# EAGLE schematic CANSAT (EAGLE 9.5.1)
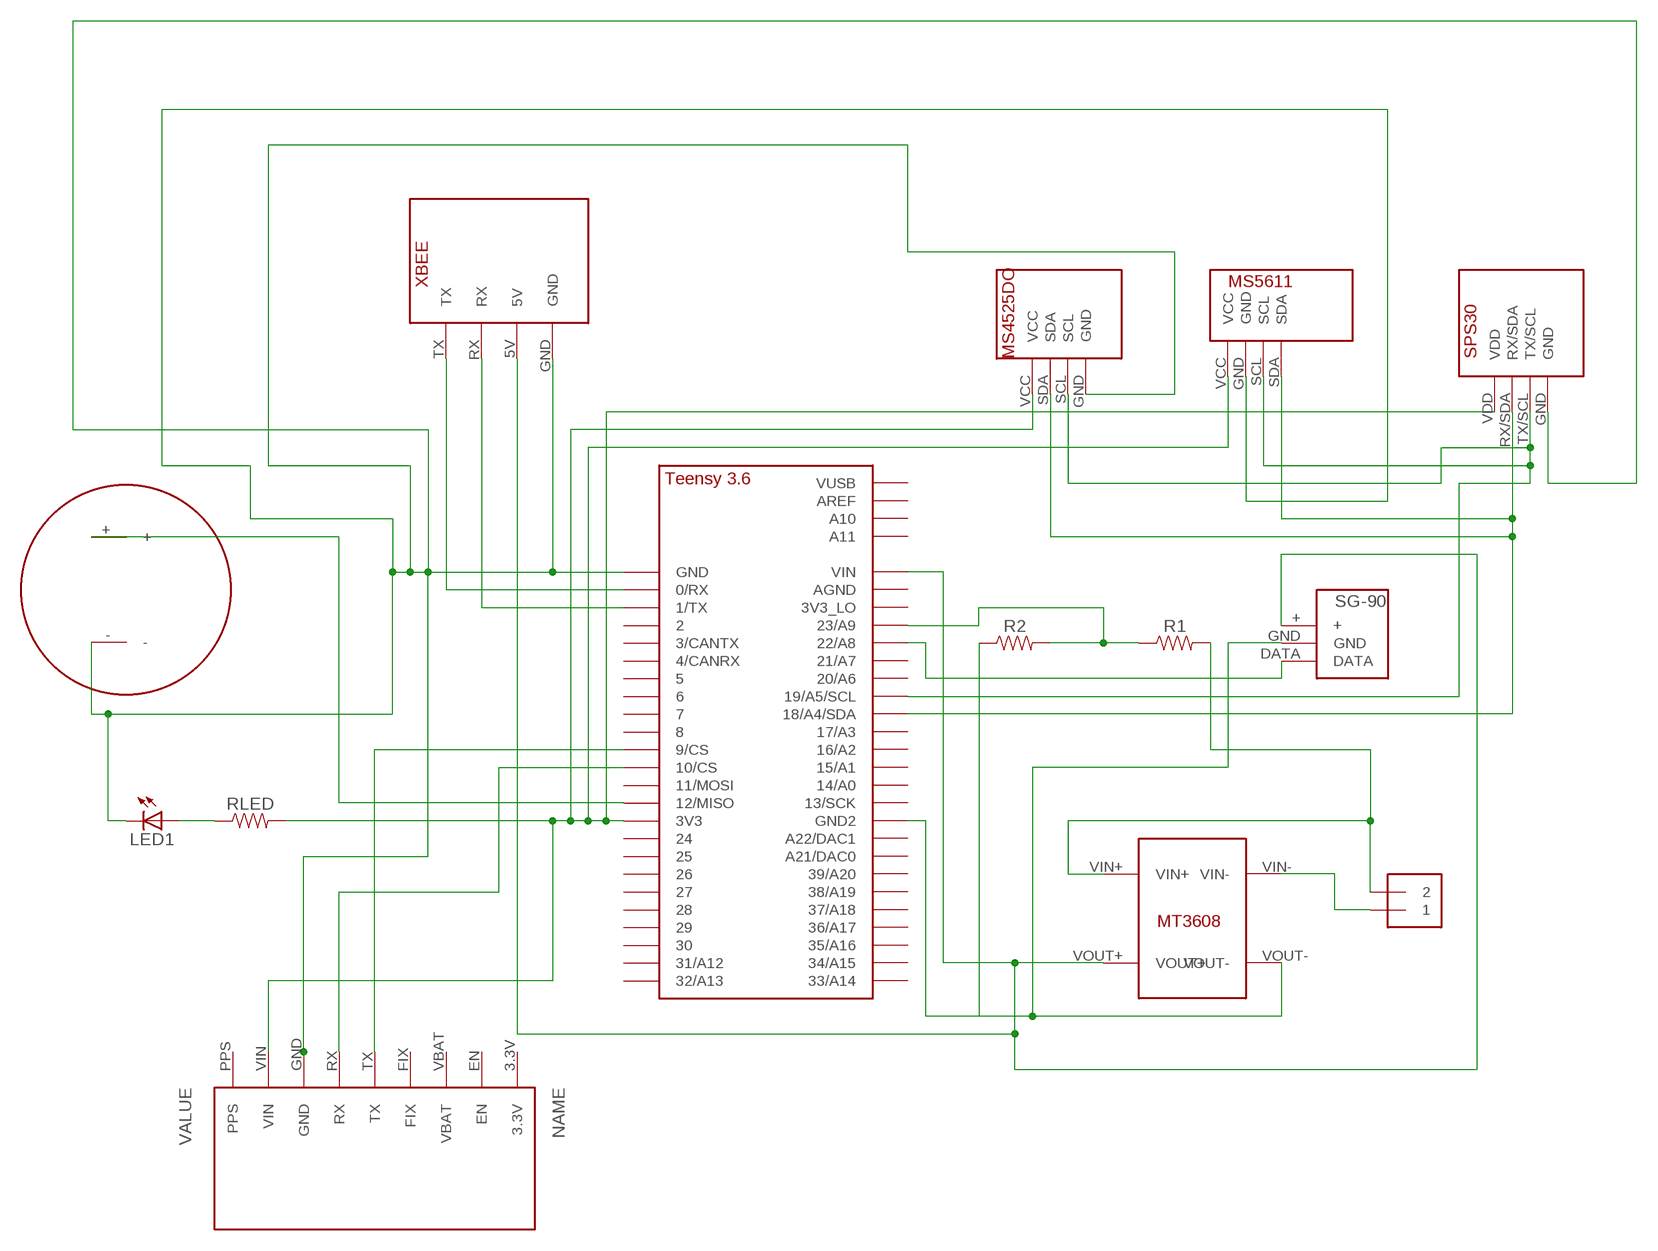
[diagram p0: schematic, sheet 1]

## Parts
GPS1  ADAFRUITGPSBREAKOUT  [ADAFRUITGPS]
J1  1X2-3.5MM  [1X2-3.5MM]
LED1  LED5MM  [LED5MM]
R1  1.2K  RESISTORAXIAL-0.3  [AXIAL-0.3]
R2  2.5K  RESISTORAXIAL-0.3  [AXIAL-0.3]
RLED  220  RESISTORAXIAL-0.3  [AXIAL-0.3]
U$1  MT3608  [MT3608]
U$2  TEENSY_3.5/3.6_BASIC  [TEENSY_3.5/3.6_BASIC]
U$3  XBEE-S2CPRO  [XBEE-S2CPRO]
U$4  MS4525DO  [MS4525DO]
U$5  MS5611  [MS5611]
U$6  SPS30  [SPS30]
U$7  AL-3035  [BUZZER]
U$8  SG-90  [SG-90]

## Nets
3V3: GPS1.VIN RLED.P$2 U$2.3V3 U$4.VCC U$5.VCC U$6.VDD
5V: U$1.VOUT+ U$2.VIN U$3.5V U$8.+
GND: GPS1.GND LED1.K(C) U$2.GND U$3.GND U$4.GND U$5.GND U$6.GND U$7.-
GND2: R2.P$1 U$1.VOUT- U$2.GND2 U$8.GND
N$1: U$2.0/RX U$3.TX
N$2: LED1.A RLED.P$1
N$3: U$2.1/TX U$3.RX
N$4: J1.2 R1.P$2 U$1.VIN+
N$5: J1.1 U$1.VIN-
N$6: U$2.22/A8 U$8.DATA
N$7: U$2.12/MISO U$7.+
N$8: GPS1.TX U$2.9/CS
N$9: R1.P$1 R2.P$2 U$2.23/A9
N$10: GPS1.RX U$2.10/CS
SCL: U$2.19/A5/SCL U$4.SCL U$5.SCL U$6.TX/SCL
SDA: U$2.18/A4/SDA U$4.SDA U$5.SDA U$6.RX/SDA
Unconnected: GPS1.3.3V GPS1.EN GPS1.FIX GPS1.PPS GPS1.VBAT U$2.2 U$2.3/CANTX U$2.3V3_LO U$2.4/CANRX U$2.5 U$2.6 U$2.7 U$2.8 U$2.11/MOSI U$2.13/SCK U$2.14/A0 U$2.15/A1 U$2.16/A2 U$2.17/A3 U$2.20/A6 U$2.21/A7 U$2.21/DAC0(A21/DAC0) U$2.24 U$2.25 U$2.26 U$2.27 U$2.28 U$2.29 U$2.30 U$2.31/A12 U$2.32/A13 U$2.33/A14 U$2.34/A15 U$2.35/A16 U$2.36/A17 U$2.37/A18 U$2.38/A19 U$2.39/A20 U$2.A10 U$2.A11 U$2.A22/DAC1 U$2.AGND U$2.AREF U$2.VUSB

## Library data of the parts
GPS1 = AdafruitGPSbreakout:ADAFRUITGPSBREAKOUT
J1 = adafruit:1X2: 3.5mm Terminal block http://www.ladyada.net/library/pcb/eaglelibrary.html
LED1 = adafruit:LED: LED OSRAM: - CHIPLED LG R971, LG N971, LY N971, LG Q971, LY Q971, LO R971, LY R971 LH N974, LH R974 LS Q976, LO Q976, LY Q976 LO Q996 - Hyper CHIPLED LW Q18S LB Q993, LB Q99A, LB R99A - SideLED LS A670, LO A670, LY A670, LG A670, LP A670 LB A673, LV A673, LT A673, LW A673 LH A674 LY A675 LS A676, LA A676, LO A676, LY A676, LW A676 LS A679, LY A679, LG A679 - Hyper Micro SIDELED® LS Y876, LA Y876, LO Y876, LY Y876 LT Y87S - SmartLED LW L88C, LW L88S LB L89C, LB L89S, LG L890 LS L89K, LO L89K, LY L89K LS L896, LA L896, LO L896, LY L896 - TOPLED LS T670, LO T670, LY T670, LG T670, LP T670 LSG T670, LSP T670, LSY T670, LOP T670, LYG T670 LG T671, LOG T671, LSG T671 LB T673, LV T673, LT T673, LW T673 LH T674 LS T676, LA T676, LO T676, LY T676, LB T676, LH T676, LSB T676, LW T676 LB T67C, LV T67C, LT T67C, LS T67K, LO T67K, LY T67K, LW E67C LS E67B, LA E67B, LO E67B, LY E67B, LB E67C, LV E67C, LT E67C LW T67C LS T679, LY T679, LG T679 LS T770, LO T770, LY T770, LG T770, LP T770 LB T773, LV T773, LT T773, LW T773 LH T774 LS E675, LA E675, LY E675, LS T675 LS T776, LA T776, LO T776, LY T776, LB T776 LHGB T686 LT T68C, LB T68C - Hyper Mini TOPLED® LB M676 - Mini TOPLED Santana® LG M470 LS M47K, LO M47K, LY M47K Source: http://www.osram.convergy.de/
R1 R2 RLED = SparkFun-Resistors:RESISTOR: Generic Resistor Package
U$1 = MT3608:MT3608
U$2 = JC_Teensy356:TEENSY_3.5/3.6_BASIC
U$3 = XBEE-S2CPRO:XBEE-S2CPRO
U$4 = MS4525DO:MS4525DO
U$5 = MS5611:MS5611
U$6 = SPS30:SPS30
U$7 = Al-3035:AL-3035
U$8 = SG90:SG-90

## Net classes
0 default: width 0.254 mm, drill 0.508 mm, clearance 0.381 mm